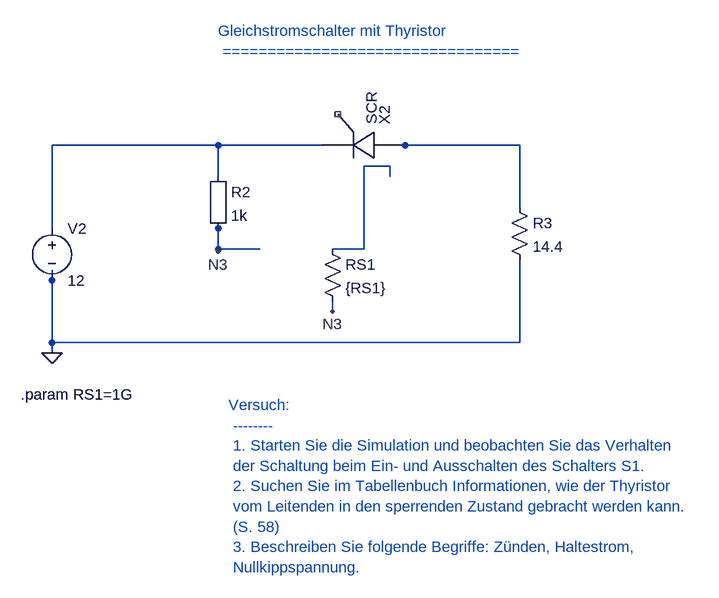
[diagram p0: schematic 11_1_1_Thyristor_als_Gleichstromschalter_1.asc]
11_1_1_Thyristor_als_Gleichstromschalter_1.asc, the LTspice schematic file:
Version 4
SHEET 1 880 680
WIRE 632 320 632 304
WIRE 632 304 592 304
WIRE 656 272 624 272
WIRE 112 480 112 464
WIRE 832 448 832 464
WIRE 112 400 112 272
WIRE 112 272 368 272
WIRE 112 592 112 576
WIRE 832 368 832 272
WIRE 832 272 624 272
WIRE 112 576 112 464
WIRE 832 464 832 576
WIRE 832 576 112 576
WIRE 368 272 528 272
WIRE 368 320 368 272
WIRE 368 400 368 432
WIRE 368 432 432 432
WIRE 544 432 592 432
WIRE 592 432 592 304
WIRE 368 400 368 436
WIRE 544 512 544 528
FLAG 112 592 0
FLAG 368 436 N3
FLAG 544 528 N3
SYMBOL SCR 592 272 M270
SYMATTR InstName X2
SYMATTR Prefix X
SYMATTR SpiceModel SCR
SYMBOL voltage 112 384 R0
SYMATTR InstName V2
SYMATTR Value 12
SYMBOL res 528 416 R0
SYMATTR InstName RS1
SYMATTR Value {RS1}
SYMBOL Misc\EuropeanResistor 352 304 R0
SYMATTR InstName R2
SYMATTR Value 1k
SYMBOL res 816 352 R0
SYMATTR InstName R3
SYMATTR Value 14.4
TEXT 64 656 Left 2 !.param RS1=1G
TEXT 368 96 Left 2 ;Gleichstromschalter mit Thyristor \n =================================
TEXT 384 672 Left 2 ;Versuch: \n -------- \n 1. Starten Sie die Simulation und beobachten Sie das Verhalten \n der Schaltung beim Ein- und Ausschalten des Schalters S1. \n 2. Suchen Sie im Tabellenbuch Informationen, wie der Thyristor \n vom Leitenden in den sperrenden Zustand gebracht werden kann. \n (S. 58) \n 3. Beschreiben Sie folgende Begriffe: Zünden, Haltestrom, \n Nullkippspannung.

The netlist it stands for:
* 11_1_1_Thyristor_als_Gleichstromschalter_1.asc
XX2 N002 NC_01 N003 SCR SCR  ; pins A G K
V2 N003 0 12
RS1 N001 N3 {RS1}
R2 N003 N3 1k
R3 N002 0 14.4
.param RS1=1G
* Gleichstromschalter mit Thyristor
*  =================================
* Versuch:
*  --------
*  1. Starten Sie die Simulation und beobachten Sie das Verhalten
*  der Schaltung beim Ein- und Ausschalten des Schalters S1.
*  2. Suchen Sie im Tabellenbuch Informationen, wie der Thyristor
*  vom Leitenden in den sperrenden Zustand gebracht werden kann.
*  (S. 58)
*  3. Beschreiben Sie folgende Begriffe: Zünden, Haltestrom,
*  Nullkippspannung.
.backanno
.end